# Altium schematic sheet Sheet5.SchDoc
size A4
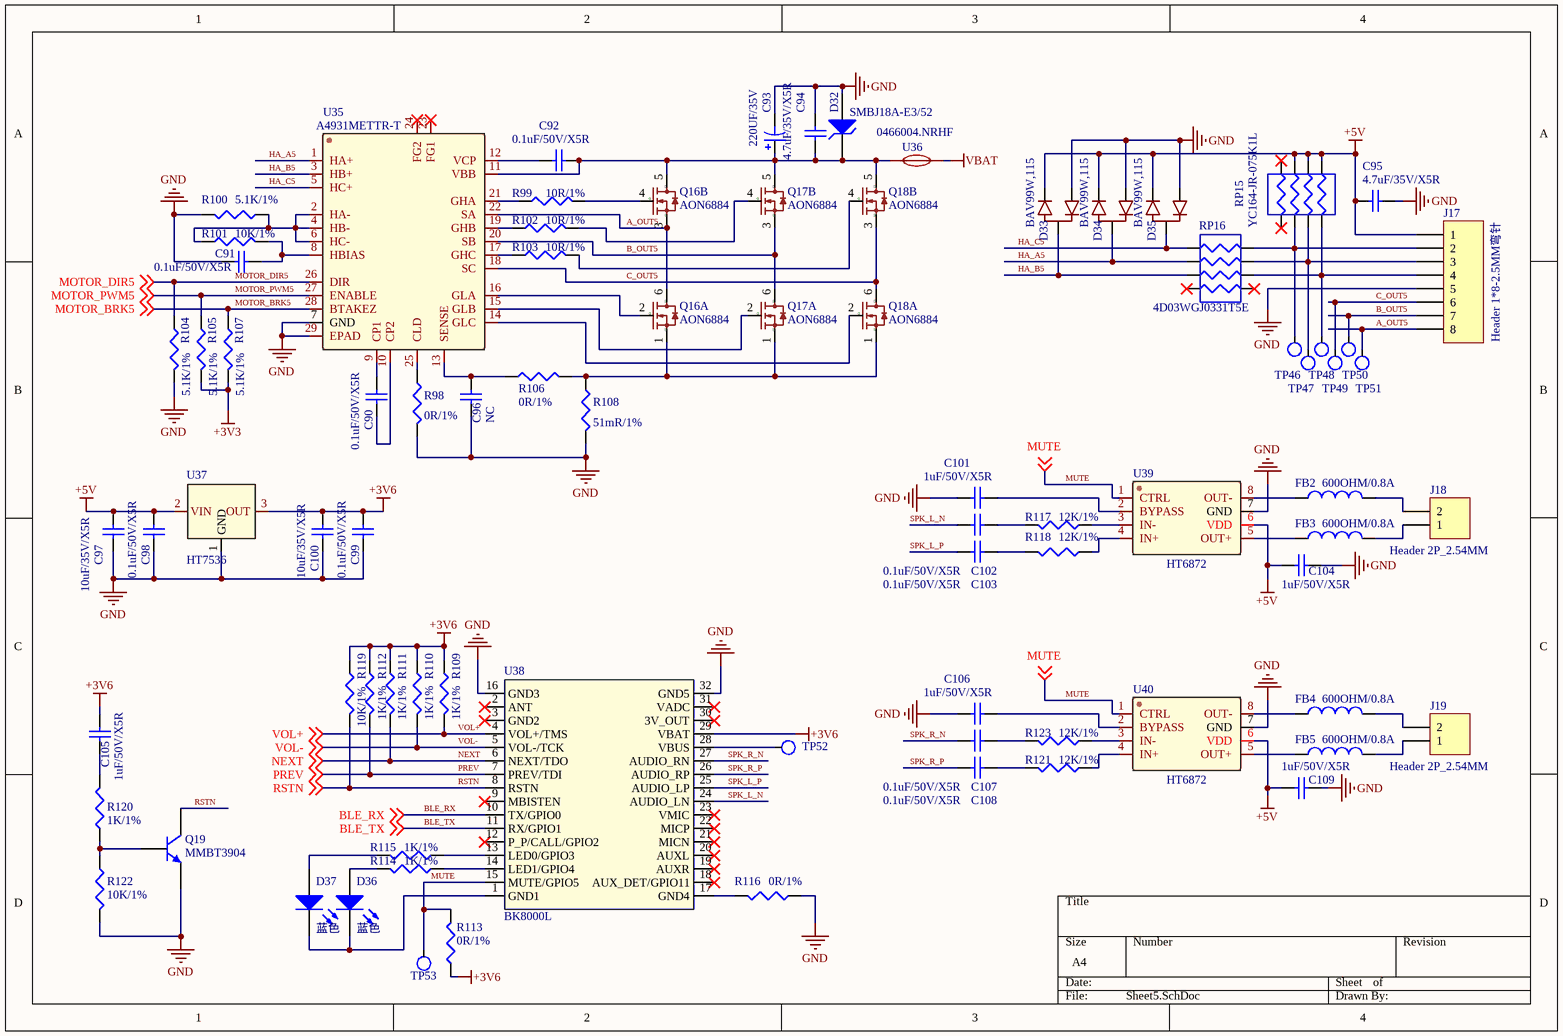
[diagram p0: Sheet5.SchDoc]

## Parts
C90  0.1uF/50V/X5R  [C0603]
C91  0.1uF/50V/X5R  [C0603]
C92  0.1uF/50V/X5R  [C0603]
C93  220UF/35V  [SMD_8X10.2]
C94  4.7uF/35V/X5R  [C0805]
C95  4.7uF/35V/X5R  [C0603]
C96  NC  [C0603]
C97  10uF/35V/X5R  [C0805]
C98  0.1uF/50V/X5R  [C0603]
C99  0.1uF/50V/X5R  [C0603]
C100  10uF/35V/X5R  [C0805]
C101  1uF/50V/X5R  [C0603]
C102  0.1uF/50V/X5R  [C0603]
C103  0.1uF/50V/X5R  [C0603]
C104  1uF/50V/X5R  [C0603]
C105  1uF/50V/X5R  [C0603]
C106  1uF/50V/X5R  [C0603]
C107  0.1uF/50V/X5R  [C0603]
C108  0.1uF/50V/X5R  [C0603]
C109  1uF/50V/X5R  [C0603]
D32  SMBJ18A-E3/52  [SMB]
D33  BAV99W,115
D34  BAV99W,115
D35  BAV99W,115
D36  蓝色  [LED0603]
D37  蓝色  [LED0603]
FB2  600OHM/0.8A  [FB0805]
FB3  600OHM/0.8A  [FB0805]
FB4  600OHM/0.8A  [FB0805]
FB5  600OHM/0.8A  [FB0805]
J17  Header 1*8-2.5MM弯针  [DIP_8X2.5]
J18  Header 2P_2.54MM  [DIP_2X2.54]
J19  Header 2P_2.54MM  [DIP_2X2.54]
Q16  AON6884  [AOS]  (parts A,B of 2)
Q17  AON6884  [AOS]  (parts A,B of 2)
Q18  AON6884  [AOS]  (parts A,B of 2)
Q19  MMBT3904  [SOT-23]
R98  0R/1%  [R0603]
R99  10R/1%  [R0603]
R100  5.1K/1%  [R0603]
R101  10K/1%  [R0603]
R102  10R/1%  [R0603]
R103  10R/1%  [R0603]
R104  5.1K/1%  [R0603]
R105  5.1K/1%  [R0603]
R106  0R/1%  [R0603]
R107  5.1K/1%  [R0603]
R108  51mR/1%  [R0805]
R109  1K/1%  [R0603]
R110  1K/1%  [R0603]
R111  1K/1%  [R0603]
R112  1K/1%  [R0603]
R113  0R/1%  [R0603]
R114  1K/1%  [R0603]
R115  1K/1%  [R0603]
R116  0R/1%  [R0603]
R117  12K/1%  [R0603]
R118  12K/1%  [R0603]
R119  10K/1%  [R0603]
R120  1K/1%  [R0603]
R121  12K/1%  [R0603]
R122  10K/1%  [R0603]
R123  12K/1%  [R0603]
RP15  YC164-JR-075K1L  [RP-1206]
RP16  4D03WGJ0331T5E  [RP-1206]
TP46  TP  [TP]  (value not drawn)
TP47  TP  [TP]  (value not drawn)
TP48  TP  [TP]  (value not drawn)
TP49  TP  [TP]  (value not drawn)
TP50  TP  [TP]  (value not drawn)
TP51  TP  [TP]  (value not drawn)
TP52  TP  [TP]  (value not drawn)
TP53  TP  [TP]  (value not drawn)
U35  A4931METTR-T  [QFN-28]
U36  0466004.NRHF  [1206]
U37  HT7536
U38  BK8000L  [BT]
U39  HT6872  [SOIC-8]
U40  HT6872  [SOIC-8]

## Nets
+3V3: R105.2 R107.2
+3V6: C99.1 C100.1 C105.1 R109.1 R110.1 R111.1 R112.1 R113.1 R119.1 U37.3(OUT) U38.29(VBAT)
+5V: C95.1 C97.2 C98.2 C104.2 C109.1 D33.2 D34.2 D35.2 J17.1 RP15.1 RP15.2 RP15.3 U37.2(VIN) U39.6(VDD) U40.6(VDD)
GND: C91.1 C93.2 C94.2 C95.2 C96.2 C97.1 C98.1 C99.2 C100.2 C101.2 C104.1 C106.2 C109.2 D32.1(A) D33.1 D34.1 D35.1 J17.5 Q19.2(E) R98.2 R100.2 R104.2 R108.2 R116.1 R122.2 U35.7(GND) U35.29(EPAD) U37.1(GND) U38.16(GND3) U38.32(GND5) U39.7(GND) U40.7(GND)
VBAT: U36.2
A_OUT5: J17.8 Q16.3(S) Q16.6 TP51.1 U35.22(SA)
B_OUT5: J17.7 Q17.3(S) Q17.6 TP50.1 U35.20(SB)
BLE_RX: U38.10(TX/GPIO0) ; off-sheet BLE_RX
BLE_TX: U38.11(RX/GPIO1) ; off-sheet BLE_TX
C_OUT5: J17.6 Q18.3(S) Q18.6 TP49.1 U35.18(SC)
HA_A5: D34.3 RP16.2 U35.1(HA+)
HA_B5: D33.3 RP16.3 U35.3(HB+)
HA_C5: D35.3 RP16.1 U35.5(HC+)
MOTOR_BRK5: R107.1 U35.28(BTAKEZ) ; off-sheet MOTOR_BRK5
MOTOR_DIR5: R104.1 U35.26(DIR) ; off-sheet MOTOR_DIR5
MOTOR_PWM5: R105.1 U35.27(ENABLE) ; off-sheet MOTOR_PWM5
MUTE: R113.2 TP53.1 U38.15(MUTE/GPIO5) U39.1(CTRL) U40.1(CTRL) ; off-sheet MUTE
NEXT: R111.2 U38.6(NEXT/TDO) ; off-sheet NEXT
PREV: R112.2 U38.7(PREV/TDI) ; off-sheet PREV
RSTN: Q19.3(C) R119.2 U38.8(RSTN) ; off-sheet RSTN
SPK_L_N: C102.1 U38.24(AUDIO_LN)
SPK_L_P: C103.1 U38.25(AUDIO_LP)
SPK_R_N: C107.2 U38.27(AUDIO_RN)
SPK_R_P: C108.2 U38.26(AUDIO_RP)
VOL+: R109.2 U38.4(VOL+/TMS) ; off-sheet VOL+
VOL-: R110.2 U38.5(VOL-/TCK) ; off-sheet VOL-
NetC90_1: C90.1 U35.9(CP1)
NetC90_2: C90.2 U35.10(CP2)
NetC91_2: C91.2 R101.2 U35.8(HBIAS)
NetC92_1: C92.1 U35.12(VCP)
NetC92_2: C92.2 C93.1 C94.1 D32.2(K) Q16.5(D) Q17.5(D) Q18.5(D) U35.11(VBB) U36.1
NetC96_1: C96.1 R106.1 U35.13(SENSE)
NetC101_1: C101.1 U39.2(BYPASS)
NetC102_2: C102.2 R117.2
NetC103_2: C103.2 R118.2
NetC105_2: C105.2 R120.2
NetC106_1: C106.1 U40.2(BYPASS)
NetC107_1: C107.1 R123.2
NetC108_1: C108.1 R121.2
NetD36_1: D36.1(A) R114.2
NetD36_2: D36.2(K) D37.2(K) U38.1(GND1)
NetD37_1: D37.1(A) R115.2
NetFB2_1: FB2.1 U39.8(OUT-)
NetFB2_2: FB2.2 J18.2
NetFB3_1: FB3.1 U39.5(OUT+)
NetFB3_2: FB3.2 J18.1
NetFB4_1: FB4.1 U40.8(OUT-)
NetFB4_2: FB4.2 J19.2
NetFB5_1: FB5.1 U40.5(OUT+)
NetFB5_2: FB5.2 J19.1
NetJ17_2: J17.2 RP15.6 RP16.8 TP46.1
NetJ17_3: J17.3 RP15.7 RP16.7 TP47.1
NetJ17_4: J17.4 RP15.8 RP16.6 TP48.1
NetQ16_1: Q16.1(S) Q17.1(S) Q18.1(S) R106.2 R108.1
NetQ16_2: Q16.2(G) U35.16(GLA)
NetQ16_4: Q16.4(G) R99.2
NetQ17_2: Q17.2(G) U35.15(GLB)
NetQ17_4: Q17.4(G) R102.2
NetQ18_2: Q18.2(G) U35.14(GLC)
NetQ18_4: Q18.4(G) R103.2
NetQ19_1: Q19.1(B) R120.1 R122.1
NetR98_1: R98.1 U35.25(CLD)
NetR99_1: R99.1 U35.21(GHA)
NetR100_1: R100.1 R101.1 U35.2(HA-) U35.4(HB-) U35.6(HC-)
NetR102_1: R102.1 U35.19(GHB)
NetR103_1: R103.1 U35.17(GHC)
NetR114_1: R114.1 U38.14(LED1/GPIO4)
NetR115_1: R115.1 U38.13(LED0/GPIO3)
NetR116_2: R116.2 U38.17(GND4)
NetR117_1: R117.1 U39.3(IN-)
NetR118_1: R118.1 U39.4(IN+)
NetR121_1: R121.1 U40.4(IN+)
NetR123_1: R123.1 U40.3(IN-)
NetTP52_1: TP52.1 U38.28(VBUS)

Not connected (* = marked no-connect by the designer): RP15 4* 5*; RP16 4* 5*; U35 23(FG1)* 24(FG2)*; U38 2(ANT)* 3(GND2)* 9(MBISTEN)* 12(P_P/CALL/GPIO2)* 18(AUX_DET/GPIO11)* 19(AUXR)* 20(AUXL)* 21(MICN)* 22(MICP)* 23(VMIC)* 30(3V_OUT)* 31(VADC)*

## Library data of the parts
C90-C92 C94-C109 = Cap Semi: Capacitor (Semiconductor SIM Model); Value: 100pF; Published: 8-Jun-2000; LatestRevisionDate: 29-May-2009; LatestRevisionNote: IPC-7351 Footprint Added.; PackageReference: C1206; Publisher: Altium Limited; PackageDescription: Chip Capacitor
C93 = Cap Pol1: Polarized Capacitor (Radial); Value: 100pF; Published: 8-Jun-2000; LatestRevisionDate: 17-Jul-2002; LatestRevisionNote: Re-released for DXP Platform.; PackageReference: RB7.6-15; Publisher: Altium Limited; PackageDescription: Polarized Capacitor (Radial); 2 Leads
D32 = D Zener: Zener Diode; Published: 8-Jun-2000; LatestRevisionDate: 17-Jul-2002; LatestRevisionNote: Re-released for DXP Platform.; PackageReference: DIODE-0.7; Publisher: Altium Limited; PackageDescription: Diode, Thru-Hole; 2 Leads; 0.7 in Pin Spacing
D36 D37 = LED2: Typical RED, GREEN, YELLOW, AMBER GaAs LED; Published: 8-Jun-2000; LatestRevisionDate: 17-Jul-2002; LatestRevisionNote: Re-released for DXP Platform.; PackageVersion: Feb-2002; PackageReference: 3.2X1.6X1.1; Publisher: Altium Limited; PackageDescription: SM LED; 2 Flat Leads
FB2-FB5 = Inductor: Code_IEC: 1005; Value: 10mH; Published: 8-Jun-2000; LatestRevisionDate: 29-May-2009; LatestRevisionNote: IPC-7351 Footprint Added.; PackageReference: 0402-A; Publisher: Altium Limited; PackageDescription: Chip Inductor; Code_JEITA: 0402
J17 = Header 8: Header, 8-Pin; LatestRevisionDate: 17-Jul-2002; LatestRevisionNote: Re-released for DXP Platform.; Publisher: Altium Limited
J18 J19 = Header 2: Header, 2-Pin; LatestRevisionDate: 17-Jul-2002; LatestRevisionNote: Re-released for DXP Platform.; Publisher: Altium Limited
R98-R123 = Res3: Resistor; Value: 1K; Published: 8-Jun-2000; LatestRevisionDate: 29-May-2009; LatestRevisionNote: IPC-7351 Footprint Added.; PackageReference: J1-0603; Publisher: Altium Limited; PackageDescription: Chip Resistor
RP15 RP16 = RP